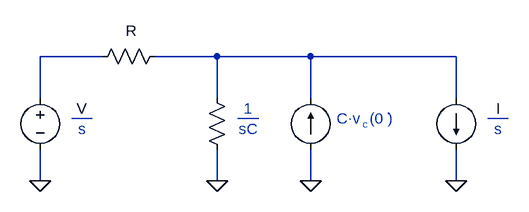
[diagram p0: schematic MathDesc.asc]
MathDesc.asc, the LTspice schematic file:
Version 4
SHEET 1 880 680
WIRE 32 64 -64 64
WIRE 208 64 112 64
WIRE 352 64 208 64
WIRE 576 64 352 64
WIRE -64 128 -64 64
WIRE 208 128 208 64
WIRE 352 128 352 64
WIRE 576 128 576 64
WIRE -64 256 -64 208
WIRE 208 256 208 208
WIRE 352 256 352 208
WIRE 576 256 576 208
FLAG -64 256 0
FLAG 208 256 0
FLAG 352 256 0
FLAG 576 256 0
SYMBOL res 128 48 R90
WINDOW 0 0 56 Invisible 2
WINDOW 3 -39 52 VTop 2
SYMATTR InstName R1
SYMBOL res 192 112 R0
WINDOW 0 36 40 Invisible 2
WINDOW 3 36 76 Invisible 2
SYMATTR InstName R2
SYMATTR Value 1/(sCx)
SYMBOL current 352 208 R180
WINDOW 0 24 80 Invisible 2
WINDOW 3 24 0 Invisible 2
SYMATTR InstName I1
SYMBOL current 576 128 R0
WINDOW 0 24 0 Invisible 2
WINDOW 3 65 32 Bottom 2
SYMATTR InstName I2
SYMBOL voltage -64 112 R0
WINDOW 0 24 16 Invisible 2
WINDOW 3 64 48 Bottom 2
SYMATTR InstName V1
TEXT 0 160 Top 2 ;s
TEXT 256 160 Bottom 2 ;1
TEXT 256 160 Top 2 ;sC
TEXT 392 160 Left 2 ;C·v  (0 )
TEXT 640 160 Top 2 ;s
TEXT 472 152 Center 0 ;+
TEXT 432 168 Left 1 ;c
LINE Normal 16 160 -16 160
LINE Normal 272 160 240 160
LINE Normal 656 160 624 160

The netlist it stands for:
* MathDesc.asc
R1 N002 N001 R
R2 N002 0 1/(sCx)
I1 0 N002 I
I2 N002 0 I
V1 N001 0 V
* s
* 1
* sC
* C·v  (0 )
* s
* +
* c
.backanno
.end